# EAGLE design Adafruit Bluefruit LE Shield (EAGLE 6.4)
COMPANY: ADAFRUIT INDUSTRIES; DRAWN: KTOWN; REV: B
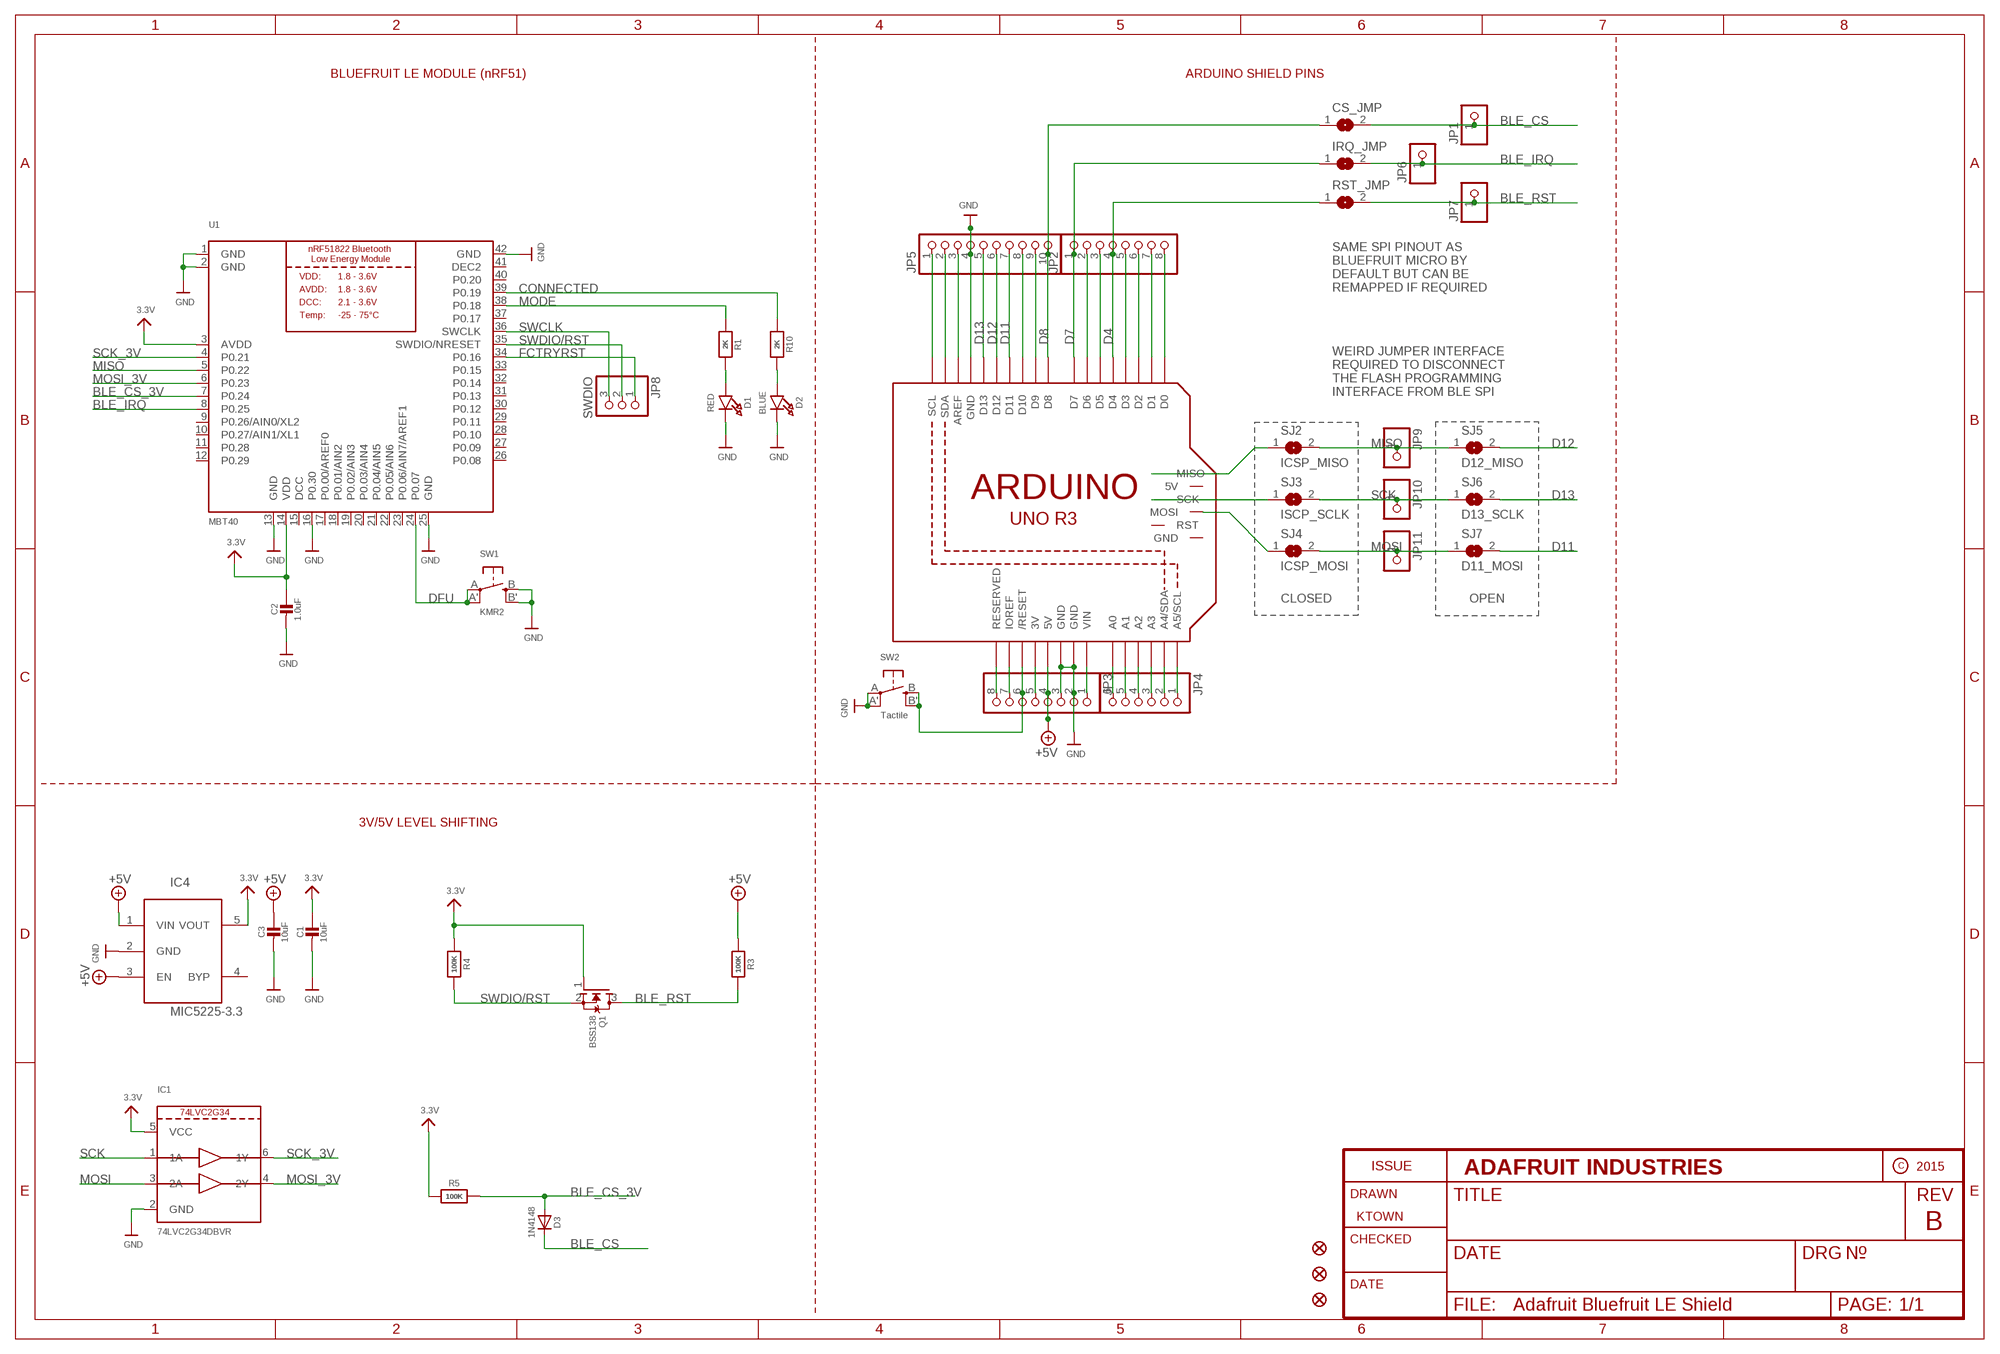
[diagram p0: schematic, sheet 1]

## Parts
C1  10uF  CAP_CERAMIC0805-NOOUTLINE  [0805-NO]
C2  1.0uF  CAP_CERAMIC0805-NOOUTLINE  [0805-NO]
C3  10uF  CAP_CERAMIC0805-NOOUTLINE  [0805-NO]
CS_JMP  SOLDERJUMPERCLOSED  [SOLDERJUMPER_CLOSEDWIRE]
D1  RED  LED0805_NOOUTLINE  [CHIPLED_0805_NOOUTLINE]
D2  BLUE  LED0805_NOOUTLINE  [CHIPLED_0805_NOOUTLINE]
D3  1N4148  DIODESOD-323  [SOD-323]
FID1  FIDUCIAL""  [FIDUCIAL_1MM]
FID2  FIDUCIAL""  [FIDUCIAL_1MM]
FID3  FIDUCIAL""  [FIDUCIAL_1MM]
IC1  74LVC2G34DBVR  [SOT23-6]
IC4  MIC5225-3.3  LP298XS  [SOT23-5L]
IRQ_JMP  SOLDERJUMPERCLOSED  [SOLDERJUMPER_CLOSEDWIRE]
JP1  HEADER-1X1ROUND  [1X01_ROUND]
JP2  HEADER-1X870MIL  [1X08_ROUND_70]
JP3  HEADER-1X870MIL  [1X08_ROUND_70]
JP4  HEADER-1X670MIL  [1X06_ROUND_70]
JP5  HEADER-1X1070MIL  [1X10_ROUND70]
JP6  HEADER-1X1ROUND  [1X01_ROUND]
JP7  HEADER-1X1ROUND  [1X01_ROUND]
JP8  SWDIO  HEADER-1X376MIL  [1X03_ROUND_76]
JP9  HEADER-1X1ROUND  [1X01_ROUND]
JP10  HEADER-1X1ROUND  [1X01_ROUND]
JP11  HEADER-1X1ROUND  [1X01_ROUND]
M1  ARDUINO_R3_ICSP_NODIM  [ARDUINOR3_ICSP_NODIM]
Q1  BSS138  MOSFET-NWIDE  [SOT23-WIDE]
R1  2K  RESISTOR0805_NOOUTLINE  [0805-NO]
R3  100K  RESISTOR0805_NOOUTLINE  [0805-NO]
R4  100K  RESISTOR0805_NOOUTLINE  [0805-NO]
R5  100K  RESISTOR0805_NOOUTLINE  [0805-NO]
R10  2K  RESISTOR0805_NOOUTLINE  [0805-NO]
RST_JMP  SOLDERJUMPERCLOSED  [SOLDERJUMPER_CLOSEDWIRE]
SJ2  ICSP_MISO  SOLDERJUMPERCLOSED  [SOLDERJUMPER_CLOSEDWIRE]
SJ3  ISCP_SCLK  SOLDERJUMPERCLOSED  [SOLDERJUMPER_CLOSEDWIRE]
SJ4  ICSP_MOSI  SOLDERJUMPERCLOSED  [SOLDERJUMPER_CLOSEDWIRE]
SJ5  D12_MISO  SOLDERJUMPERREFLOW_NOPASTE  [SOLDERJUMPER_REFLOW_NOPASTE]
SJ6  D13_SCLK  SOLDERJUMPERREFLOW_NOPASTE  [SOLDERJUMPER_REFLOW_NOPASTE]
SJ7  D11_MOSI  SOLDERJUMPERREFLOW_NOPASTE  [SOLDERJUMPER_REFLOW_NOPASTE]
SW1  KMR2  SWITCH_TACT_SMT4.6X2.8  [BTN_KMR2_4.6X2.8]
SW2  Tactile  SWITCH_TACT_SMT  [EVQ-Q2]
U1  MBT40  NRF51822_MODULE_MDBT40  [BLE_MODULE_RAYTAC_MDBT40]

## Nets
3.3V: C1.1 C2.1 IC1.5(VCC) IC4.5(VOUT) Q1.1(G) R4.1 R5.1 U1.3(AVDD) U1.14(VDD)
+3V: JP3.5 M1.3V
+5V: C3.1 IC4.1(VIN) IC4.3(EN) JP3.4 M1.5V R3.1
A0: JP4.6 M1.A0
A1: JP4.5 M1.A1
A2: JP4.4 M1.A2
A3: JP4.3 M1.A3
A4: JP4.2 M1.A4(A4/SDA)
A5: JP4.1 M1.A5(A5/SCL)
AREF: JP5.3 M1.AREF
BLE_CS: CS_JMP.2 D3.C JP1.1
BLE_CS_3V: D3.A R5.2 U1.7(P0.24)
BLE_IRQ: IRQ_JMP.2 JP6.1 U1.8(P0.25)
BLE_RST: JP7.1 Q1.3(D) R3.2 RST_JMP.2
CONNECTED: R10.1 U1.39(P0.19)
D4: JP2.4 M1.D4 RST_JMP.1
D7: IRQ_JMP.1 JP2.1 M1.D7
D8: CS_JMP.1 JP5.10 M1.D8
D11: JP5.7 M1.D11 SJ7.2
D12: JP5.6 M1.D12 SJ5.2
D13: JP5.5 M1.D13 SJ6.2
DFU: SW1.A'(P1) SW1.A(P) U1.24(P0.07)
FCTRYRST: JP8.1 U1.34(P0.16)
GND: C1.2 C2.2 C3.2 D1.C D2.C IC1.2(GND) IC4.2(GND) JP3.2 JP3.3 JP5.4 M1.GND M1.GND@1(GND) M1.GND@3(GND) SW1.B'(S1) SW1.B(S) SW2.A'(P1) SW2.A(P) U1.1(GND) U1.2(GND) U1.13(GND) U1.16(P0.30) U1.25(GND) U1.42(GND)
IOREF: JP3.7 M1.IOREF
MISO: JP9.1 SJ2.2 SJ5.1 U1.5(P0.22)
MISO_ICSP: M1.MISO SJ2.1
MODE: R1.1 U1.38(P0.18)
MOSI: IC1.3(2A) JP11.1 SJ4.2 SJ7.1
MOSI_3V: IC1.4(2Y) U1.6(P0.23)
MOSI_ICSP: M1.MOSI SJ4.1
N$5: D1.A R1.2
N$6: D2.A R10.2
N$11: JP2.2 M1.D6
N$12: JP2.3 M1.D5
N$14: JP2.5 M1.D3
N$15: JP2.6 M1.D2
N$16: JP2.7 M1.D1
N$17: JP2.8 M1.D0
N$36: JP5.8 M1.D10
N$37: JP5.9 M1.D9
NC: JP3.8 M1.RESERVED
RESET: JP3.6 M1.RESET(/RESET) SW2.B'(S1) SW2.B(S)
SCK: IC1.1(1A) JP10.1 SJ3.2 SJ6.1
SCK_3V: IC1.6(1Y) U1.4(P0.21)
SCK_ICSP: M1.SCK SJ3.1
SCL: JP5.1 M1.SCL
SDA: JP5.2 M1.SDA
SWCLK: JP8.3 U1.36(SWCLK)
SWDIO/RST: JP8.2 Q1.2(S) R4.2 U1.35(SWDIO/NRESET)
VIN: JP3.1 M1.VIN
Unconnected: IC4.4(BYP) M1.5V_ICSP(5V) M1.GND@2(GND) M1.RESET_ICSP(RST) U1.9(P0.26/AIN0/XL2) U1.10(P0.27/AIN1/XL1) U1.11(P0.28) U1.12(P0.29) U1.17(P0.00/AREF0) U1.18(P0.01/AIN2) U1.19(P0.02/AIN3) U1.20(P0.03/AIN4) U1.21(P0.04/AIN5) U1.22(P0.05/AIN6) U1.23(P0.06/AIN7/AREF1) U1.26(P0.08) U1.27(P0.09) U1.28(P0.10) U1.29(P0.11) U1.30(P0.12) U1.31(P0.13) U1.32(P0.14) U1.33(P0.15) U1.37(P0.17) U1.40(P0.20)

## Notes on the sheet
- BLUEFRUIT LE MODULE (nRF51) | ARDUINO SHIELD PINS
- SAME SPI PINOUT AS
  BLUEFRUIT MICRO BY
  DEFAULT BUT CAN BE
  REMAPPED IF REQUIRED
- WEIRD JUMPER INTERFACE
  REQUIRED TO DISCONNECT
  THE FLASH PROGRAMMING
  INTERFACE FROM BLE SPI
- CLOSED | OPEN
- 3V/5V LEVEL SHIFTING

## Power pins joined to a net without a drawn wire
DCC: U1.15(DCC)
DEC2: U1.41(DEC2)

## Library data of the parts
C1-C3 = microbuilder:CAP_CERAMIC: Ceramic Capacitors For new designs, use the packages preceded by an '_' character since they are more reliable: The following footprints should be used on most boards: _0402 - Standard footprint for regular board layouts _0603 - Standard footprint for regular board layouts _0805 - Standard footprint for regular board layouts _1206 - Standard footprint for regular board layouts For extremely tight-pitch boards where space is at a premium, the following 'micro-pitch' footprints can be used (smaller pads, no silkscreen outline, etc.): _0402MP - Micro-pitch footprint for very dense/compact boards _0603MP - Micro-pitch footprint for very dense/compact boards _0805MP - Micro-pitch footprint for very dense/compact boards _1206MP - Micro-pitch footprint for very dense/compact boards
CS_JMP IRQ_JMP RST_JMP SJ2-SJ7 = microbuilder:SOLDERJUMPER: SMD Solder JUMPER Solder the two pads together to create a connection, or remove the solder to break it. REFLOW - Use this footprint for solder paste and reflow ovens. WAVE - Use this footprint for hand-soldering (larger pads). CLOSED - Has a trace between the two pads to ensure it is closed by default. The trace needs to be cut to disable the jumper, and can be closed again by creating a solder bridge between the two pads.
D1 D2 = microbuilder:LED: LED 0603 - 0603 Surface Mount Package 2mA: Green LED - Low Power (3.9mcd, 2ma, 1.7Vf) - Digikey: 475-2709-2-ND Orange LED - Low Power (9.8mcd, 2ma, 1.8Vf) - Digikey: 475-1194-2-ND Red LED - Low Power (5mcd, 2ma, 1.8Vf) - Digikey: 475-1195-2-ND Yellow LED - Low Power (7mcd, 2ma, 1.8Vf) - Digikey: 475-1196-2-ND 5mA: Blue LED - Low Power (17mcd, 5ma, 2.9Vf) - Digikey: LNJ937W8CRACT-ND 0805 - 0805 Surface Mount Package 2mA: Red LED (8.8mcd, 2mA, 1.8Vf, Clear) - Low Power [Digikey: 475-2510-1-ND] Green LED (5mcd, 2mA, 1.8Vf, Clear) - Low Power [Digikey: 475-2730-1-ND] Yellow LED (11.3mcd, 2mA, 1.8Vf, Clear) - Low Power [Digikey: 475-2555-1-ND] 20mA: Red LED (104mcd, 20mA, Diffused) - LS R976 [Digikey: 475-1278-6-ND] Red LED (12mcd, 20mA, 2.0Vf, Clear) - APT2012EC [Digikey: 754-1128-1-ND] Green LED (15mcd, 20mA, 2.2Vf, Clear) - APT2012GC [Digikey: 754-1131-1-ND] Orange LED (160mcd, 20mA, 2.1Vf, Clear) - APT2012SECK [Digikey: 754-1130-1-ND] 1206 - 1206 Surface Mount Package Green LED (26mcd, 20mA, Diffused) - LG N971 [Digikey: 475-1407-6-ND] Red LED (15mcd, 20mA, Diffused) - LH N974 [Digikey: 475-1416-6-ND] Cree - Cree High-Power Surface Mount LEDs XPEBWT-L1-0000-00D50 - White 111lm 350mA 2.9Vf 6200K 110° XTEAWT-00-0000-00000LEE3 - White 114lm 350mA 2.85Vf 5000K 115° Everlight - Everlight 45-21 Series Surface Mount LEDs 45-21/QK2C-B2832AC2CB2/2T - Warm White 2000mcd 20mA 3.25Vf 3050K 120° 45-21/LK2C-B38452C4CB2/2T - Nuetral White 2000mcd 20mA 3.25Vf 4150K 120° 45-21/LK2C-B50634C6CB2/2T - Cold White 2200mcd 20mA 3.25Vf 5650K 120° PLCC2 Reverse Mount LS T77K-J1L2-1-0-2-R18-Z - Red 11.25mcd 2mA 1.8Vf 630nm 120° LO T77K-L1M2-24-Z - Orange 19.6mcd 2mA 1.8Vf 606nm 120° LY T77K-K2M1-26-Z - Yellow 15.7mcd 2mA 1.8Vf 587nm 120°
D3 = microbuilder:DIODE: Diode SMA Model Volts Amps Type Vf Ir Digikey # Notes SSA34-E3 40V 3A Schottky 480mV @ 3A 200uA @ 40V SSA34-E3/61TGITR-ND CDBA120-G 20V 1A Schottky 500mV @ 1A 500uA @ 20V 641-1014-6-ND REEL MBRA210 10V 2A Schottky 350mV @ 2A 700uA @ 10V MBRA210LT3 SOD-123 Model Volts Amps Type Vf Ir Order # Notes BAT54T1G 30V 200mA Schottky 800mV @ 200mA 2uA @ 25V BAT54T1GOSTR-ND B0530W 30V 500mA Schottky 430mV @ 500mA 130uA @ 30V B0530W-FDICT-ND REEL MBR120 20V 1A Schottky 340mV @ 1A MBR120VLSFT1GOSCT-ND SOD-323 Model Volts Amps Type Vf Ir Order # Notes PMEG2005EJ 20V 500mA Schottky 355mV @ 500mA 568-4110-1-ND ZLLS410 10V 570mA Schottky 380mV @ 570mA ZLLS410CT-ND 1N4148WS 75V 150mA Silicon/Simple 1V 1N4148WSFSCT-ND REEL SOD-523 Model Volts Amps Type Vf Ir Order # Notes BAT54XV2 30V 200mA Schottky 0.8V @ 100mA BAT54XV2CT-ND TB751S 30V 30mA Schottky RB751S-40TE61CT-ND SOT23-R/W (R = Solder Paste/Reflow Ovens, W = Hand-Soldering) Model Volts Amps Type Vf Ir Order # Notes BAT54FILM 40V 300mA Schottky 497-7162-1-ND POWERDI-5 Model Volts Amps Type Vf Ir Order # Notes PDS560 60V 5A Schottky 670mV @ 5A 150uA @ 60V PDS560DICT-ND
FID1-FID3 = microbuilder:FIDUCIAL: Fiducial Alignment Points Various fiducial points for machine vision alignment.; BOM: EXCLUDE
IC1 = microbuilder:74LVC2G34
IC4 = adafruit:LP298X
JP1 JP6 JP7 JP9-JP11 = microbuilder:HEADER-1X1: PIN HEADER
JP2 JP3 = microbuilder:HEADER-1X8: PIN HEADER
JP4 = microbuilder:HEADER-1X6: PIN HEADER
JP5 = microbuilder:HEADER-1X10: PIN HEADER
JP8 = microbuilder:HEADER-1X3: PIN HEADER
M1 = adafruit:ARDUINO_R3_ICSP
Q1 = microbuilder:MOSFET-N: N-Channel Mosfet LEGEND VDS: Voltage Drain-Source ID: Drain Current RDS(ON): Drain-Source On-State Resistance VGS(TH): Gate-Source Threshold Voltage CISS: Drain-Source Input Capacitance SOT-23 Name VDS ID RDS(ON) VGS(TH) CISS Order Number 2N7002E 60V 260mA 2.5 Ohm 2.5V @ 250uA 26.7pF @ 25V 2N7002ET1GOSTR-ND BSH103 30V 850mA 400 mOhm 400mV @ 1mA 83pF @ 24V BSH103,235-ND BSS138 60V 320mA 1.6 Ohm 1.5V @ 250uA 50pF @ 10V Mouser: 771-BSS138PW115 DMN2075U-7 20V 4.2A 38 mOhm 1V @ 250 uA 594.3pF @ 10V DMN2075U-7DICT-ND * BSS138 good choice for I2C level-shifting POWERPAK 1212-8 Name VDS ID RDS(ON) VGS(TH) CISS Order Number Si7308DN 60V 6A 58 mOhm 3V @ 250uA 665pF @ 15V SI7308DN-T1-E3CT-ND
R1 R3-R5 R10 = microbuilder:RESISTOR: Resistors For new designs, use the packages preceded by an '_' character since they are more reliable: The following footprints should be used on most boards: _0402 - Standard footprint for regular board layouts _0603 - Standard footprint for regular board layouts _0805 - Standard footprint for regular board layouts _1206 - Standard footprint for regular board layouts For extremely tight-pitch boards where space is at a premium, the following 'micro-pitch' footprints can be used (smaller pads, no silkscreen outline, etc.): _0402MP - Micro-pitch footprint for very dense/compact boards _0603MP - Micro-pitch footprint for very dense/compact boards _0805MP - Micro-pitch footprint for very dense/compact boards _1206MP - Micro-pitch footprint for very dense/compact boards
SW1 SW2 = microbuilder:SWITCH_TACT_SMT: SMT Tact Switches 6x6mm - Digikey: P12940SCT-ND KMR2 (4.6x2.8mm) - Digikey: 401-1426-1-ND EVQ-PQHB55 - Light Touch, 160GF (4.5x4.5mm) - Digikey: P8090SCT-ND KMT0 - KMT021 NGJ LHS (etc.) IP68/Waterproof - Digikey: CKN10289CT-ND
U1 = microbuilder:NRF51822_MODULE_MDBT40: nRF51822 Bluetooth Low Energy Module

## Board
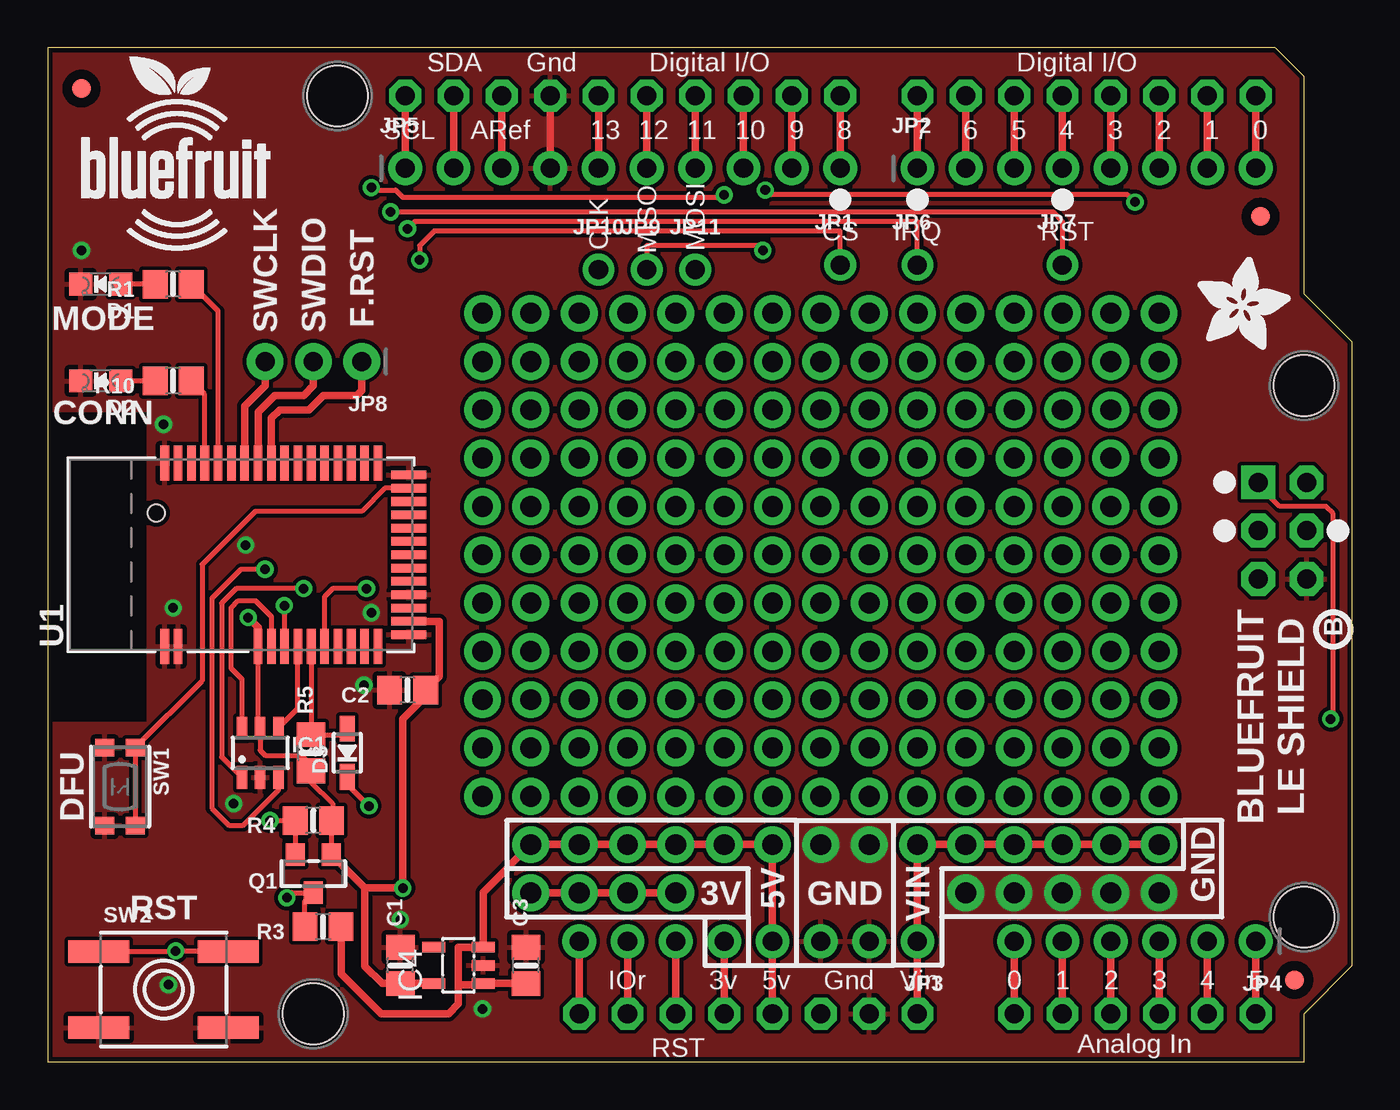
[diagram p1: board, top side]
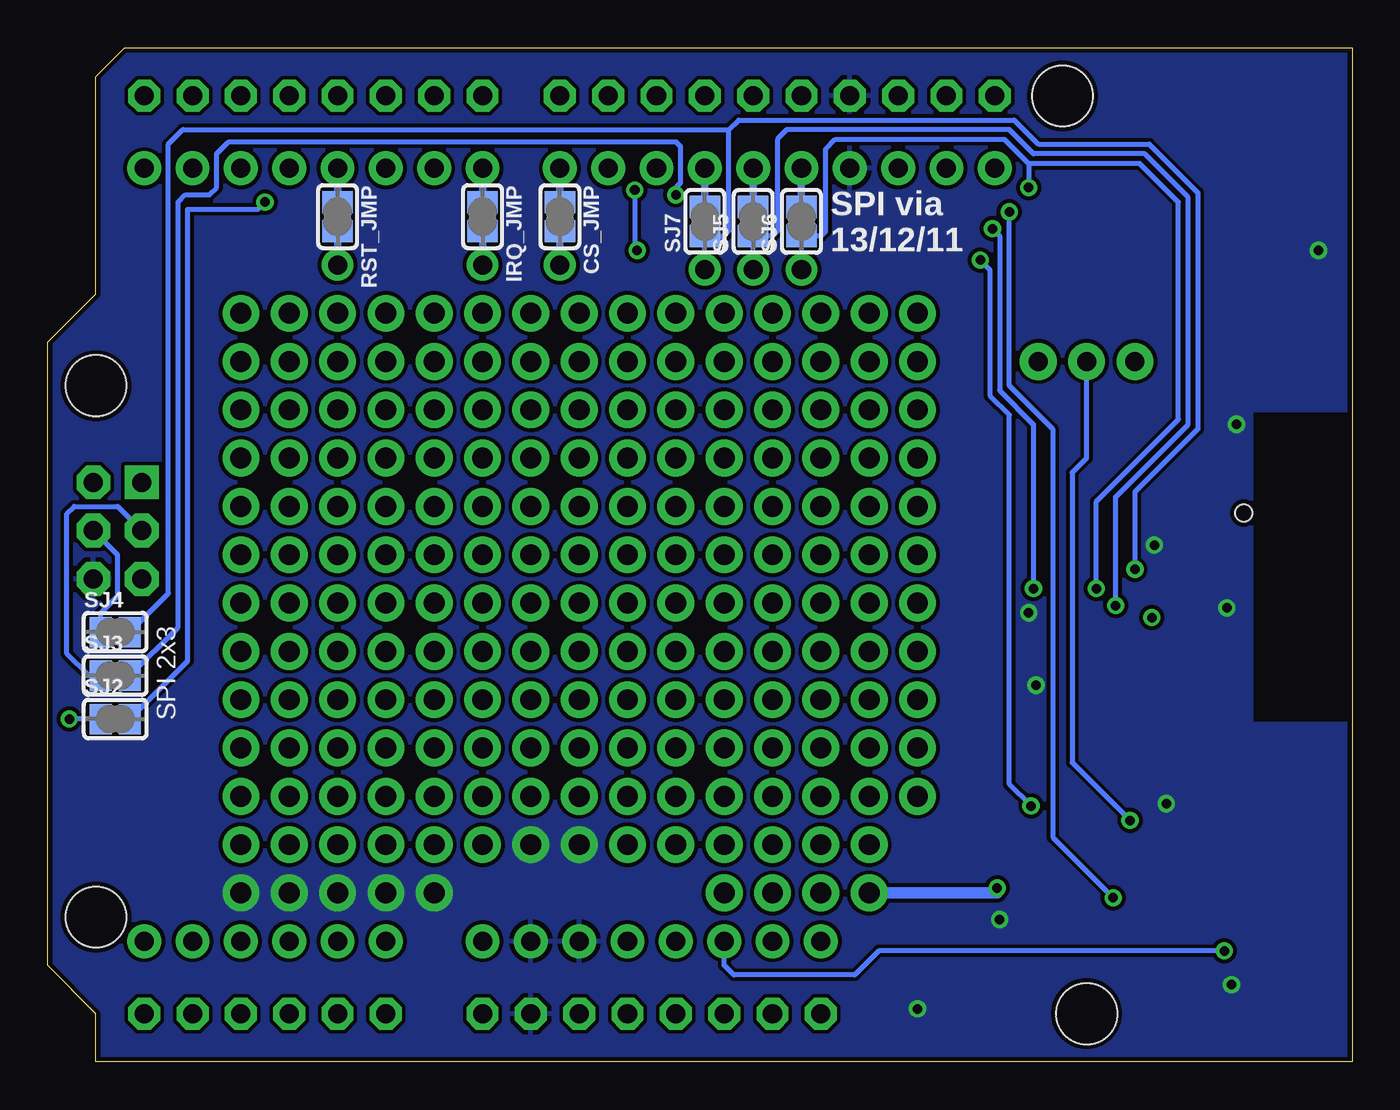
[diagram p2: board, bottom side, seen from below]

Size 68.58 x 53.34 mm. Coordinates in mm from the lower left corner, seen from the top.
Outline: 0,0 66.04,0 66.04,2.54 68.58,5.08 68.58,37.85 66.04,40.39 66.04,51.82 64.52,53.34 0,53.34 0,0
Copper layers (1*16): Top 0.035mm / dielectric 1.5mm / Bottom 0.035mm
Design rules "adafruit *": minimum track width 8mil, minimum drill 15.5mil, track to track 8mil, track to pad 8mil, pad to pad 8mil, via to via 8mil, smd to smd 8mil, copper to edge 10mil, drill to drill 8mil, minimum pad ring 10mil, minimum via ring 8mil, stop-mask expansion 2mil, vias tented up to drill 20mil, thermal gap 10mil
Holes 3.2 mm at 13.97,2.54 66.04,35.56 66.04,7.62 15.24,50.8

### Footprints (pad centres in the part's own frame; a part is rotated, then mirrored left to right if it is on the bottom)
0805-NO = smd 1.3 x 1.5: 1 -0.95,0; 2 0.95,0
SOLDERJUMPER_CLOSEDWIRE = smd 1.168 x 1.6: 1 -0.762,0; 2 0.762,0 | smd 0.635 x 0.203: WIRE 0,0
CHIPLED_0805_NOOUTLINE = smd 1.2 x 1.2: A 0,-1.05; C 0,1.05
SOD-323 = smd 1.35 x 0.8: A 1.27,0; C -1.27,0
FIDUCIAL_1MM = smd 1 x 1: 1 0,0
SOT23-6 = smd 0.55 x 1.2: 1 -0.95,-1.3; 2 0,-1.3; 3 0.95,-1.3; 4 0.95,1.3; 5 0,1.3; 6 -0.95,1.3
SOT23-5L = smd 0.55 x 1.2: 1 -0.95,-1.3; 2 0,-1.3; 3 0.95,-1.3; 4 0.95,1.3; 5 -0.95,1.3
1X01_ROUND = drill 1 pad 1.676: 1 0,0
1X08_ROUND_70 = drill 1 pad 1.778: 1 -8.89,0; 2 -6.35,0; 3 -3.81,0; 4 -1.27,0; 5 1.27,0; 6 3.81,0; 7 6.35,0; 8 8.89,0
1X06_ROUND_70 = drill 1 pad 1.778: 1 -6.35,0; 2 -3.81,0; 3 -1.27,0; 4 1.27,0; 5 3.81,0; 6 6.35,0
1X10_ROUND70 = drill 1 pad 1.778: 1 -11.43,0; 2 -8.89,0; 3 -6.35,0; 4 -3.81,0; 5 -1.27,0; 6 1.27,0; 7 3.81,0; 8 6.35,0; 9 8.89,0; 10 11.43,0
1X03_ROUND_76 = drill 1 pad 1.93: 1 -2.54,0; 2 0,0; 3 2.54,0
ARDUINOR3_ICSP_NODIM = drill 1 pad 1.676 octagon: 3V 35.56,2.54; 5V 38.1,2.54; A0 50.8,2.54; A1 53.34,2.54; A2 55.88,2.54; A3 58.42,2.54; A4 60.96,2.54; A5 63.5,2.54; AREF 23.876,50.8; D0 63.5,50.8; D1 60.96,50.8; D2 58.42,50.8; D3 55.88,50.8; D4 53.34,50.8; D5 50.8,50.8; D6 48.26,50.8; D7 45.72,50.8; D8 41.656,50.8; D9 39.116,50.8; D10 36.576,50.8; D11 34.036,50.8; D12 31.496,50.8; D13 28.956,50.8; GND 26.416,50.8; GND@1 43.18,2.54; GND@2 40.64,2.54; IOREF 30.48,2.54; RESERVED 27.94,2.54; RESET 33.02,2.54; SCL 18.796,50.8; SDA 21.336,50.8; VIN 45.72,2.54 | drill 1 pad 1.778 octagon: 5V_ICSP 66.167,30.48; GND@3 66.167,25.4; MOSI 66.167,27.94; RESET_ICSP 63.627,25.4; SCK 63.627,27.94 | drill 1 pad 1.778 square: MISO 63.627,30.48
SOT23-WIDE = smd 1 x 1.2: 1 -0.95,-1; 2 0.95,-1; 3 0,1
SOLDERJUMPER_REFLOW_NOPASTE = smd 1.168 x 1.6: 1 -0.762,0; 2 0.762,0
BTN_KMR2_4.6X2.8 = smd 0.9 x 1: A 2.05,0.8; A' -2.05,0.8; B 2.05,-0.8; B' -2.05,-0.8
EVQ-Q2 = smd 3.2 x 1.2: A -3.4,-2; A' 3.4,-2; B -3.4,2; B' 3.4,2
BLE_MODULE_RAYTAC_MDBT40 = smd 1.85 x 0.45: 1 -4.825,4; 2 -4.825,3.3; 3 -4.825,-0.9; 4 -4.825,-1.6; 5 -4.825,-2.3; 6 -4.825,-3; 7 -4.825,-3.7; 8 -4.825,-4.4; 9 -4.825,-5.1; 10 -4.825,-5.8; 11 -4.825,-6.5; 12 -4.825,-7.2; 26 4.825,-7.2; 27 4.825,-6.5; 28 4.825,-5.8; 29 4.825,-5.1; 30 4.825,-4.4; 31 4.825,-3.7; 32 4.825,-3; 33 4.825,-2.3; 34 4.825,-1.6; 35 4.825,-0.9; 36 4.825,-0.2; 37 4.825,0.5; 38 4.825,1.2; 39 4.825,1.9; 40 4.825,2.6; 41 4.825,3.3; 42 4.825,4 | smd 0.45 x 1.85: 13 -4.2,-8.825; 14 -3.5,-8.825; 15 -2.8,-8.825; 16 -2.1,-8.825; 17 -1.4,-8.825; 18 -0.7,-8.825; 19 0,-8.825; 20 0.7,-8.825; 21 1.4,-8.825; 22 2.1,-8.825; 23 2.8,-8.825; 24 3.5,-8.825; 25 4.2,-8.825 | hole 0.9: 2.2,4.45

### Placement (x,y rotation side)
C1  18.54,5.08 90 top
C2  18.92,19.56 180 top
C3  25.15,5.08 90 top
CS_JMP  41.66,44.45 270 bottom
D1  2.79,40.89 90 top
D2  2.79,35.81 90 top
D3  15.75,16.26 90 top
FID1  63.75,44.45 0 top
FID2  65.53,4.32 0 top
FID3  1.78,51.18 0 top
IC1  11.18,16.26 0 top
IC4  21.59,5.08 90 top
IRQ_JMP  45.72,44.45 270 bottom
JP1  41.66,41.91 0 top
JP2  54.61,46.99 0 top
JP3  36.83,6.35 180 top
JP4  57.15,6.35 180 top
JP5  30.23,46.99 0 top
JP6  45.72,41.91 0 top
JP7  53.34,41.91 0 top
JP8  13.97,36.83 180 top
JP9  31.5,41.66 0 top
JP10  28.96,41.66 0 top
JP11  34.04,41.66 0 top
M1  0,0 0 top
Q1  13.97,9.91 180 top
R1  6.6,40.89 180 top
R3  14.48,7.11 180 top
R4  13.97,12.7 180 top
R5  13.84,16.26 90 top
R10  6.6,35.81 180 top
RST_JMP  53.34,44.45 270 bottom
SJ2  65.02,18.03 0 bottom
SJ3  65.02,20.32 0 bottom
SJ4  65.02,22.61 0 bottom
SJ5  31.5,44.2 90 bottom
SJ6  28.96,44.2 90 bottom
SJ7  34.04,44.2 90 bottom
SW1  3.81,14.48 270 top
SW2  6.1,3.81 0 top
U1  10.16,26.67 90 top
U$8  [BLUEFRUITLOGO_100MM]  1.78,42.67 0 top
U$9  [ADAFRUIT_5MM]  60.45,37.47 0 top
U$21  [PCBFEAT-REV-040]  67.56,22.73 90 top

### Tracks (layer width: path | path; a pad name or v marks a point on that pad's centre or on a via)
3.3V  (via drill 0.5, 1.1 pad 1.93)
  Top 0.254: Q1.1 R4.1 14.99,12.77 14.99,13.59 13.84,14.73 R5.1 | U1.3 11.06,17.67 IC1.5 11.18,16.38 11.43,16.13 13.34,16.13 13.84,15.62 R5.1 | 14.22,15.24 14.03,15.24 13.96,15.31 R5.1
  Top 0.406: U1.14 20.57,23.17 20.57,20.26 C2.1 19.87,19.24 18.67,18.03 v18.67,9.14 16.68,9.14 | U1.3 11.06,22.85 v10.54,23.37 | v33.02,8.89 v30.48,8.89 v27.94,8.89 v25.4,8.89 | IC4.5 C1.1 17.59,4.13 16.68,5.04 16.68,9.14 | Q1.1 16.68,9.14
  Top 0.61: C1.1 18.67,4.26
  Bottom 0.61: v18.67,9.14 18.67,8.89 v25.4,8.89
+3V
  Top 0.406: M1.3V JP3.5
+5V  (via drill 1.1 pad 1.93)
  Top 0.406: M1.5V JP3.4 v38.1,11.43 v35.56,11.43 v33.02,11.43 v30.48,11.43 v27.94,11.43 v25.4,11.43 22.89,8.92 IC4.3 21.59,6.03 21.59,4.06 | 21.59,4.06 22.89,4.06 IC4.1 C3.1 | 15.81,7.49 R3.1 15.43,4.64 17.53,2.54 21.08,2.54 21.59,3.05 21.59,4.06
A0
  Top 0.406: JP4.6 M1.A0
A1
  Top 0.406: JP4.5 M1.A1
A2
  Top 0.406: JP4.4 M1.A2
A3
  Top 0.406: JP4.3 M1.A3
A4
  Top 0.406: JP4.2 M1.A4
A5
  Top 0.406: M1.A5 JP4.1
AREF
  Top 0.406: JP5.3 M1.AREF
BLE_CS  (via drill 0.5)
  Top 0.254: JP1.1 CS_JMP.2 20.32,43.69 19.56,42.93 v19.56,42.16 | v16.89,13.46 15.75,14.61 D3.C
  Bottom 0.254: v19.56,42.16 19.05,41.66 19.05,35.05 18.03,34.04 18.03,14.61 v16.89,13.46
  Bottom 0.406: CS_JMP.2 JP1.1
BLE_CS_3V
  Top 0.254: U1.7 13.86,17.22 R5.2 15.43,17.21 D3.A
BLE_IRQ  (via drill 0.5)
  Top 0.254: JP6.1 45.72,44.2 19.3,44.2 v18.92,43.81 | v16.76,24.89 14.99,24.89 14.56,24.47 U1.8
  Bottom 0.254: v18.92,43.81 18.54,43.43 18.54,35.31 16.76,33.53 v16.76,24.89
  Bottom 0.406: IRQ_JMP.2 JP6.1
BLE_RST  (via drill 0.5)
  Top 0.254: v18.03,44.7 52.83,44.7 53.34,44.2 JP7.1 | R3.2 13.53,8.46 Q1.3 12.84,8.91 v12.57,8.64
  Bottom 0.254: v18.03,44.7 18.03,35.56 15.75,33.27 15.75,11.81 v12.57,8.64
  Bottom 0.406: RST_JMP.2 JP7.1
CONNECTED
  Top 0.254: U1.39 8.26,35.11 R10.1
D4
  Top 0.406: M1.D4 JP2.4
  Bottom 0.406: JP2.4 RST_JMP.1
D7
  Top 0.406: M1.D7 JP2.1
  Bottom 0.406: JP2.1 IRQ_JMP.1
D8
  Top 0.406: M1.D8 JP5.10
  Bottom 0.406: JP5.10 CS_JMP.1
D11
  Top 0.406: M1.D11 JP5.7
  Bottom 0.406: JP5.7 SJ7.2
D12
  Top 0.406: M1.D12 JP5.6
  Bottom 0.406: JP5.6 SJ5.2
D13
  Top 0.406: M1.D13 JP5.5
  Bottom 0.406: JP5.5 SJ6.2
DFU
  Top 0.254: U1.24 17.72,30.17 16.51,28.96 10.92,28.96 8.13,26.16 8.13,20.05 SW1.A' SW1.A
FCTRYRST
  Top 0.406: U1.34 11.76,33.86 12.19,34.29 13.72,34.29 14.48,35.05 16.26,35.05 16.51,35.31 JP8.1
GND  (via drill 0.5, 1.1 pad 1.93)
  Top 0.406: M1.GND JP5.4
  other vias: 1.78,42.67 10.41,27.18 17.02,23.62 6.6,23.88 6.1,33.53 48.26,8.89 50.8,8.89 53.34,8.89 55.88,8.89 58.42,8.89 40.64,11.43 43.18,11.43 6.35,4.06 22.86,2.79 9.78,13.59 16.64,19.81 18.54,7.49
  pour Top: 68.58,53.34 68.58,-0.13 0,-0.13 0,17.78 5.33,17.78 5.33,34.29 0,34.29 0,53.34
  pour Bottom: 0,53.47 0,34.29 5.33,34.29 5.33,17.78 0,17.78 0,-0.25 68.58,-0.25 68.58,53.47
IOREF
  Top 0.406: JP3.7 M1.IOREF
MISO  (via drill 0.5)
  Top 0.254: U1.5 v12.46,23.99 v12.45,24 | v57.15,45.21 56.77,45.59 37.85,45.59 37.72,45.72 v37.72,45.85 | v37.59,42.67 37.34,42.93 31.5,42.93 JP9.1
  Bottom 0.254: v12.45,24 12.45,29.72 8.64,33.53 8.64,45.47 10.92,47.75 16.76,47.75 18.03,49.02 29.72,49.02 30.23,48.51 30.23,43.69 30.48,43.43 SJ5.1 JP9.1 | SJ2.2 61.21,21.08 61.21,44.83 57.53,44.83 v57.15,45.21 | v37.72,45.85 37.72,42.8 v37.59,42.67
MISO_ICSP  (via drill 0.5)
  Top 0.254: v67.44,18.03 67.56,18.16 67.56,28.83 67.18,29.21 64.77,29.21 63.63,30.35 M1.MISO
  Bottom 0.254: SJ2.1 v67.44,18.03
MODE
  Top 0.254: U1.38 8.96,39.49 R1.1
MOSI  (via drill 0.5)
  Top 0.254: v11.43,25.91 10.16,25.91 8.64,24.38 8.64,13.34 9.53,12.45 10.29,12.45 12.13,14.29 IC1.3
  Bottom 0.254: 32.77,49.02 32.77,43.69 33.02,43.43 SJ7.1 JP11.1 | 32.77,49.02 32.26,49.53 17.78,49.53 16.51,48.26 10.67,48.26 8.13,45.72 8.13,33.27 11.43,29.97 v11.43,25.91 | SJ4.2 62.23,24.64 62.23,48.26 61.47,49.02 32.77,49.02
MOSI_3V
  Top 0.254: IC1.4 13.16,18.59 U1.6
MOSI_ICSP
  Bottom 0.254: SJ4.1 65.79,23.62 64.9,24.51 64.9,26.67 M1.MOSI
N$1  (via drill 1.1 pad 1.93)
  other vias: 25.4,39.37
N$2  (via drill 1.1 pad 1.93)
  other vias: 58.42,36.83
N$3  (via drill 1.1 pad 1.93)
  other vias: 55.88,36.83
N$4  (via drill 1.1 pad 1.93)
  other vias: 53.34,36.83
N$5
  Top 0.254: R1.2 D1.A
N$6
  Top 0.254: R10.2 D2.A
N$7  (via drill 1.1 pad 1.93)
  other vias: 50.8,36.83
N$9  (via drill 1.1 pad 1.93)
  other vias: 48.26,36.83
N$11
  Top 0.406: M1.D6 JP2.2
N$12
  Top 0.406: M1.D5 JP2.3
N$14
  Top 0.406: M1.D3 JP2.5
N$15
  Top 0.406: M1.D2 JP2.6
N$16
  Top 0.406: M1.D1 JP2.7
N$17
  Top 0.406: M1.D0 JP2.8
N$18  (via drill 1.1 pad 1.93)
  other vias: 35.56,36.83
N$31  (via drill 1.1 pad 1.93)
  other vias: 45.72,36.83
N$32  (via drill 1.1 pad 1.93)
  other vias: 43.18,36.83
N$33  (via drill 1.1 pad 1.93)
  other vias: 40.64,36.83
N$34  (via drill 1.1 pad 1.93)
  other vias: 38.1,36.83
N$35  (via drill 1.1 pad 1.93)
  other vias: 58.42,34.29
N$36
  Top 0.406: M1.D10 JP5.8
N$37
  Top 0.406: M1.D9 JP5.9
N$38  (via drill 1.1 pad 1.93)
  other vias: 55.88,34.29
N$39  (via drill 1.1 pad 1.93)
  other vias: 33.02,36.83
N$40  (via drill 1.1 pad 1.93)
  other vias: 53.34,34.29
N$41  (via drill 1.1 pad 1.93)
  other vias: 50.8,34.29
N$42  (via drill 1.1 pad 1.93)
  other vias: 48.26,34.29
N$43  (via drill 1.1 pad 1.93)
  other vias: 45.72,34.29
N$44  (via drill 1.1 pad 1.93)
  other vias: 43.18,34.29
N$45  (via drill 1.1 pad 1.93)
  other vias: 40.64,34.29
N$46  (via drill 1.1 pad 1.93)
  other vias: 38.1,34.29
N$47  (via drill 1.1 pad 1.93)
  other vias: 35.56,34.29
N$48  (via drill 1.1 pad 1.93)
  other vias: 33.02,34.29
N$49  (via drill 1.1 pad 1.93)
  other vias: 30.48,34.29
N$50  (via drill 1.1 pad 1.93)
  other vias: 27.94,34.29
N$51  (via drill 1.1 pad 1.93)
  other vias: 25.4,34.29
N$52  (via drill 1.1 pad 1.93)
  other vias: 30.48,36.83
N$53  (via drill 1.1 pad 1.93)
  other vias: 27.94,36.83
N$54  (via drill 1.1 pad 1.93)
  other vias: 25.4,36.83
N$55  (via drill 1.1 pad 1.93)
  other vias: 27.94,39.37
N$56  (via drill 1.1 pad 1.93)
  other vias: 30.48,39.37
N$57  (via drill 1.1 pad 1.93)
  other vias: 25.4,31.75
N$58  (via drill 1.1 pad 1.93)
  other vias: 27.94,31.75
N$59  (via drill 1.1 pad 1.93)
  other vias: 30.48,31.75
N$60  (via drill 1.1 pad 1.93)
  other vias: 33.02,31.75
N$61  (via drill 1.1 pad 1.93)
  other vias: 35.56,31.75
N$62  (via drill 1.1 pad 1.93)
  other vias: 38.1,31.75
N$63  (via drill 1.1 pad 1.93)
  other vias: 40.64,31.75
N$64  (via drill 1.1 pad 1.93)
  other vias: 43.18,31.75
N$65  (via drill 1.1 pad 1.93)
  other vias: 45.72,31.75
N$66  (via drill 1.1 pad 1.93)
  other vias: 48.26,31.75
N$67  (via drill 1.1 pad 1.93)
  other vias: 50.8,31.75
N$68  (via drill 1.1 pad 1.93)
  other vias: 53.34,31.75
N$69  (via drill 1.1 pad 1.93)
  other vias: 55.88,31.75
N$70  (via drill 1.1 pad 1.93)
  other vias: 58.42,31.75
N$71  (via drill 1.1 pad 1.93)
  other vias: 58.42,29.21
N$72  (via drill 1.1 pad 1.93)
  other vias: 55.88,29.21
N$73  (via drill 1.1 pad 1.93)
  other vias: 53.34,29.21
N$74  (via drill 1.1 pad 1.93)
  other vias: 50.8,29.21
N$75  (via drill 1.1 pad 1.93)
  other vias: 48.26,29.21
N$76  (via drill 1.1 pad 1.93)
  other vias: 45.72,29.21
N$77  (via drill 1.1 pad 1.93)
  other vias: 43.18,29.21
N$78  (via drill 1.1 pad 1.93)
  other vias: 40.64,29.21
N$79  (via drill 1.1 pad 1.93)
  other vias: 38.1,29.21
N$80  (via drill 1.1 pad 1.93)
  other vias: 35.56,29.21
N$81  (via drill 1.1 pad 1.93)
  other vias: 33.02,29.21
N$82  (via drill 1.1 pad 1.93)
  other vias: 30.48,29.21
N$83  (via drill 1.1 pad 1.93)
  other vias: 27.94,29.21
N$84  (via drill 1.1 pad 1.93)
  other vias: 25.4,29.21
N$85  (via drill 1.1 pad 1.93)
  other vias: 33.02,39.37
N$86  (via drill 1.1 pad 1.93)
  other vias: 35.56,39.37
N$87  (via drill 1.1 pad 1.93)
  other vias: 25.4,26.67
N$88  (via drill 1.1 pad 1.93)
  other vias: 27.94,26.67
N$89  (via drill 1.1 pad 1.93)
  other vias: 30.48,26.67
N$90  (via drill 1.1 pad 1.93)
  other vias: 33.02,26.67
N$91  (via drill 1.1 pad 1.93)
  other vias: 35.56,26.67
N$92  (via drill 1.1 pad 1.93)
  other vias: 38.1,26.67
N$93  (via drill 1.1 pad 1.93)
  other vias: 40.64,26.67
N$94  (via drill 1.1 pad 1.93)
  other vias: 43.18,26.67
N$95  (via drill 1.1 pad 1.93)
  other vias: 45.72,26.67
N$96  (via drill 1.1 pad 1.93)
  other vias: 48.26,26.67
N$97  (via drill 1.1 pad 1.93)
  other vias: 50.8,26.67
N$98  (via drill 1.1 pad 1.93)
  other vias: 53.34,26.67
N$99  (via drill 1.1 pad 1.93)
  other vias: 55.88,26.67
N$100  (via drill 1.1 pad 1.93)
  other vias: 58.42,26.67
N$101  (via drill 1.1 pad 1.93)
  other vias: 25.4,24.13
N$102  (via drill 1.1 pad 1.93)
  other vias: 25.4,21.59
N$103  (via drill 1.1 pad 1.93)
  other vias: 25.4,19.05
N$104  (via drill 1.1 pad 1.93)
  other vias: 25.4,16.51
N$105  (via drill 1.1 pad 1.93)
  other vias: 25.4,13.97
N$106  (via drill 1.1 pad 1.93)
  other vias: 38.1,39.37
N$107  (via drill 1.1 pad 1.93)
  other vias: 40.64,39.37
N$108  (via drill 1.1 pad 1.93)
  other vias: 27.94,13.97
N$109  (via drill 1.1 pad 1.93)
  other vias: 27.94,16.51
N$110  (via drill 1.1 pad 1.93)
  other vias: 27.94,19.05
N$111  (via drill 1.1 pad 1.93)
  other vias: 27.94,21.59
N$112  (via drill 1.1 pad 1.93)
  other vias: 27.94,24.13
N$113  (via drill 1.1 pad 1.93)
  other vias: 30.48,24.13
N$114  (via drill 1.1 pad 1.93)
  other vias: 30.48,21.59
N$115  (via drill 1.1 pad 1.93)
  other vias: 30.48,19.05
N$116  (via drill 1.1 pad 1.93)
  other vias: 30.48,16.51
N$117  (via drill 1.1 pad 1.93)
  other vias: 30.48,13.97
N$118  (via drill 1.1 pad 1.93)
  other vias: 43.18,39.37
N$119  (via drill 1.1 pad 1.93)
  other vias: 45.72,39.37
N$120  (via drill 1.1 pad 1.93)
  other vias: 33.02,13.97
N$121  (via drill 1.1 pad 1.93)
  other vias: 33.02,16.51
N$122  (via drill 1.1 pad 1.93)
  other vias: 33.02,19.05
N$123  (via drill 1.1 pad 1.93)
  other vias: 33.02,21.59
N$124  (via drill 1.1 pad 1.93)
  other vias: 33.02,24.13
N$125  (via drill 1.1 pad 1.93)
  other vias: 35.56,24.13
N$126  (via drill 1.1 pad 1.93)
  other vias: 35.56,21.59
N$127  (via drill 1.1 pad 1.93)
  other vias: 35.56,19.05
N$128  (via drill 1.1 pad 1.93)
  other vias: 35.56,16.51
N$129  (via drill 1.1 pad 1.93)
  other vias: 35.56,13.97
N$130  (via drill 1.1 pad 1.93)
  other vias: 48.26,39.37
N$131  (via drill 1.1 pad 1.93)
  other vias: 50.8,39.37
N$132  (via drill 1.1 pad 1.93)
  other vias: 38.1,13.97
N$133  (via drill 1.1 pad 1.93)
  other vias: 38.1,16.51
N$134  (via drill 1.1 pad 1.93)
  other vias: 38.1,19.05
N$135  (via drill 1.1 pad 1.93)
  other vias: 38.1,21.59
N$136  (via drill 1.1 pad 1.93)
  other vias: 38.1,24.13
N$137  (via drill 1.1 pad 1.93)
  other vias: 40.64,24.13
N$138  (via drill 1.1 pad 1.93)
  other vias: 40.64,21.59
N$139  (via drill 1.1 pad 1.93)
  other vias: 40.64,19.05
N$140  (via drill 1.1 pad 1.93)
  other vias: 40.64,16.51
N$141  (via drill 1.1 pad 1.93)
  other vias: 40.64,13.97
N$142  (via drill 1.1 pad 1.93)
  other vias: 53.34,39.37
N$143  (via drill 1.1 pad 1.93)
  other vias: 55.88,39.37
N$144  (via drill 1.1 pad 1.93)
  other vias: 43.18,13.97
N$145  (via drill 1.1 pad 1.93)
  other vias: 43.18,16.51
N$146  (via drill 1.1 pad 1.93)
  other vias: 43.18,19.05
N$147  (via drill 1.1 pad 1.93)
  other vias: 43.18,21.59
N$148  (via drill 1.1 pad 1.93)
  other vias: 43.18,24.13
N$149  (via drill 1.1 pad 1.93)
  other vias: 45.72,24.13
N$150  (via drill 1.1 pad 1.93)
  other vias: 48.26,24.13
N$151  (via drill 1.1 pad 1.93)
  other vias: 50.8,24.13
N$152  (via drill 1.1 pad 1.93)
  other vias: 53.34,24.13
N$153  (via drill 1.1 pad 1.93)
  other vias: 55.88,24.13
N$154  (via drill 1.1 pad 1.93)
  other vias: 58.42,24.13
N$155  (via drill 1.1 pad 1.93)
  other vias: 58.42,21.59
N$156  (via drill 1.1 pad 1.93)
  other vias: 55.88,21.59
N$157  (via drill 1.1 pad 1.93)
  other vias: 53.34,21.59
N$158  (via drill 1.1 pad 1.93)
  other vias: 50.8,21.59
N$159  (via drill 1.1 pad 1.93)
  other vias: 48.26,21.59
N$160  (via drill 1.1 pad 1.93)
  other vias: 45.72,21.59
N$161  (via drill 1.1 pad 1.93)
  other vias: 45.72,19.05
N$162  (via drill 1.1 pad 1.93)
  other vias: 45.72,16.51
N$163  (via drill 1.1 pad 1.93)
  other vias: 45.72,13.97
N$164  (via drill 1.1 pad 1.93)
  other vias: 58.42,39.37
N$165  (via drill 1.1 pad 1.93)
  other vias: 22.86,39.37
N$166  (via drill 1.1 pad 1.93)
  other vias: 48.26,13.97
N$167  (via drill 1.1 pad 1.93)
  other vias: 48.26,16.51
N$168  (via drill 1.1 pad 1.93)
  other vias: 48.26,19.05
N$169  (via drill 1.1 pad 1.93)
  other vias: 50.8,19.05
N$170  (via drill 1.1 pad 1.93)
  other vias: 50.8,16.51
N$171  (via drill 1.1 pad 1.93)
  other vias: 50.8,13.97
N$172  (via drill 1.1 pad 1.93)
  other vias: 22.86,36.83
N$173  (via drill 1.1 pad 1.93)
  other vias: 22.86,34.29
N$174  (via drill 1.1 pad 1.93)
  other vias: 22.86,31.75
N$175  (via drill 1.1 pad 1.93)
  other vias: 22.86,29.21
N$176  (via drill 1.1 pad 1.93)
  other vias: 58.42,13.97
N$177  (via drill 1.1 pad 1.93)
  other vias: 58.42,16.51
N$178  (via drill 1.1 pad 1.93)
  other vias: 58.42,19.05
N$179  (via drill 1.1 pad 1.93)
  other vias: 55.88,19.05
N$180  (via drill 1.1 pad 1.93)
  other vias: 53.34,19.05
N$181  (via drill 1.1 pad 1.93)
  other vias: 53.34,16.51
N$182  (via drill 1.1 pad 1.93)
  other vias: 53.34,13.97
N$183  (via drill 1.1 pad 1.93)
  other vias: 55.88,13.97
N$184  (via drill 1.1 pad 1.93)
  other vias: 55.88,16.51
N$185  (via drill 1.1 pad 1.93)
  other vias: 22.86,26.67
N$186  (via drill 1.1 pad 1.93)
  other vias: 22.86,24.13
N$187  (via drill 1.1 pad 1.93)
  other vias: 22.86,21.59
N$188  (via drill 1.1 pad 1.93)
  other vias: 22.86,19.05
N$189  (via drill 1.1 pad 1.93)
  other vias: 22.86,16.51
N$190  (via drill 1.1 pad 1.93)
  other vias: 22.86,13.97
NC
  Top 0.406: JP3.8 M1.RESERVED
RESET  (via drill 0.5)
  Top 0.254: SW2.B 6.7,5.81 v6.73,5.84 6.76,5.81 SW2.B'
  Top 0.406: M1.RESET JP3.6
  Bottom 0.254: v6.73,5.84 24.89,5.84 26.16,4.57 32.51,4.57 33.02,5.08 JP3.6
SCK  (via drill 0.5)
  Top 0.254: v13.46,24.89 9.91,24.89 9.14,24.13 9.14,16.04 IC1.1 | v17.02,45.97 17.14,45.85 18.29,45.85 18.67,45.47 35.43,45.47 v35.56,45.59
  Bottom 0.254: v13.46,24.89 13.46,29.46 9.14,33.78 9.14,45.21 11.18,47.24 17.02,47.24 | 17.02,47.24 18.29,48.51 27.18,48.51 27.69,48.01 27.69,43.69 27.94,43.43 SJ6.1 JP10.1 | SJ3.2 61.72,22.86 61.72,45.21 61.34,45.59 60.07,45.59 59.69,45.97 59.69,47.75 59.05,48.39 35.56,48.39 35.31,48.13 35.31,46.23 35.56,45.97 v35.56,45.59 | 17.02,47.24 v17.02,45.97
SCK_3V
  Top 0.254: IC1.6 10.23,20.13 9.65,20.7 9.65,23.88 10.03,24.26 10.92,24.26 11.76,23.42 U1.4
SCK_ICSP
  Bottom 0.254: SJ3.1 66.42,20.32 67.56,21.46 67.56,28.83 67.18,29.21 64.9,29.21 M1.SCK
SCL
  Top 0.406: JP5.1 M1.SCL
SDA
  Top 0.406: JP5.2 M1.SDA
SWCLK
  Top 0.406: U1.36 10.36,34.49 11.43,35.56 JP8.3
SWDIO/RST  (via drill 0.5)
  Top 0.254: v11.68,12.7 R4.2 Q1.2
  Top 0.406: U1.35 11.06,34.17 11.94,35.05 13.46,35.05 13.97,35.56 JP8.2
  Bottom 0.254: JP8.2 13.97,31.75 14.73,30.99 14.73,15.75 v11.68,12.7
VIN  (via drill 1.1 pad 1.93)
  Top 0.406: M1.VIN JP3.1 v45.72,11.43 v48.26,11.43 v50.8,11.43 v53.34,11.43 v55.88,11.43 v58.42,11.43

### Text on the board
tPlace: CLK | MISO | MOSI | CS | IRQ | RST | MODE | F.RST | SWCLK | SWDIO | CONN | BLUEFRUIT / LE SHIELD | DFU | 3V | 5V | GND | VIN | RST | GND
bPlace: SPI via / 13/12/11 | SPI 2x3